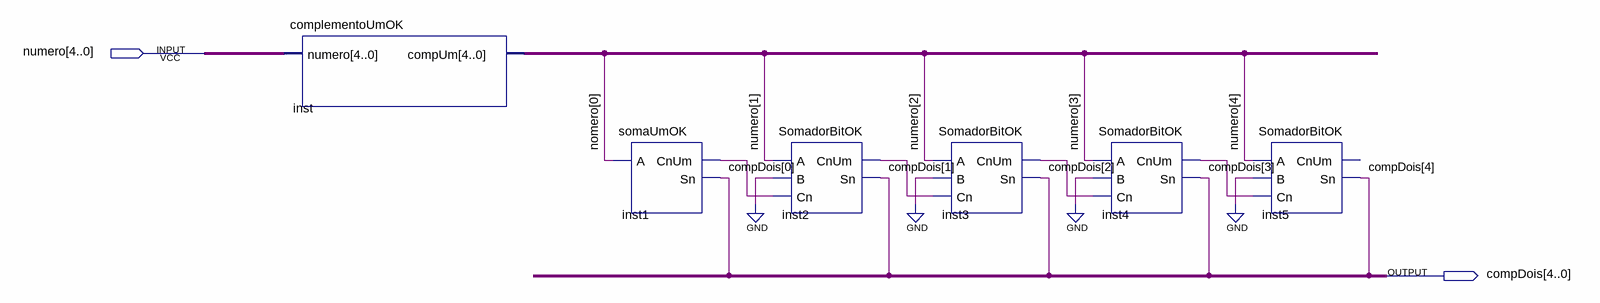
[diagram p0: schematic sheet]
// Quartus schematic complementoDoisOK.bdf as structural Verilog: 6 symbols, 2 pins
module complementoDoisOK (
  input  [4:0] numero,
  output [4:0] compDois
);

  wire inst1_cnum, inst2_cnum, inst3_cnum, inst4_cnum;
  wire [0:0] nomero;
  wire [4:0] inst_compum;

  complementoUmOK inst (.numero(numero), .compUm(inst_compum));
  somaUmOK inst1 (.A(nomero[0]), .CnUm(inst1_cnum), .Sn(compDois[0]));
  SomadorBitOK inst2 (.A(numero[1]), .B(1'b0), .Cn(inst1_cnum), .CnUm(inst2_cnum), .Sn(compDois[1]));
  SomadorBitOK inst3 (.A(numero[2]), .B(1'b0), .Cn(inst2_cnum), .CnUm(inst3_cnum), .Sn(compDois[2]));
  SomadorBitOK inst4 (.A(numero[3]), .B(1'b0), .Cn(inst3_cnum), .CnUm(inst4_cnum), .Sn(compDois[3]));
  SomadorBitOK inst5 (.A(numero[4]), .B(1'b0), .Cn(inst4_cnum), .Sn(compDois[4]));  // open: CnUm
endmodule
